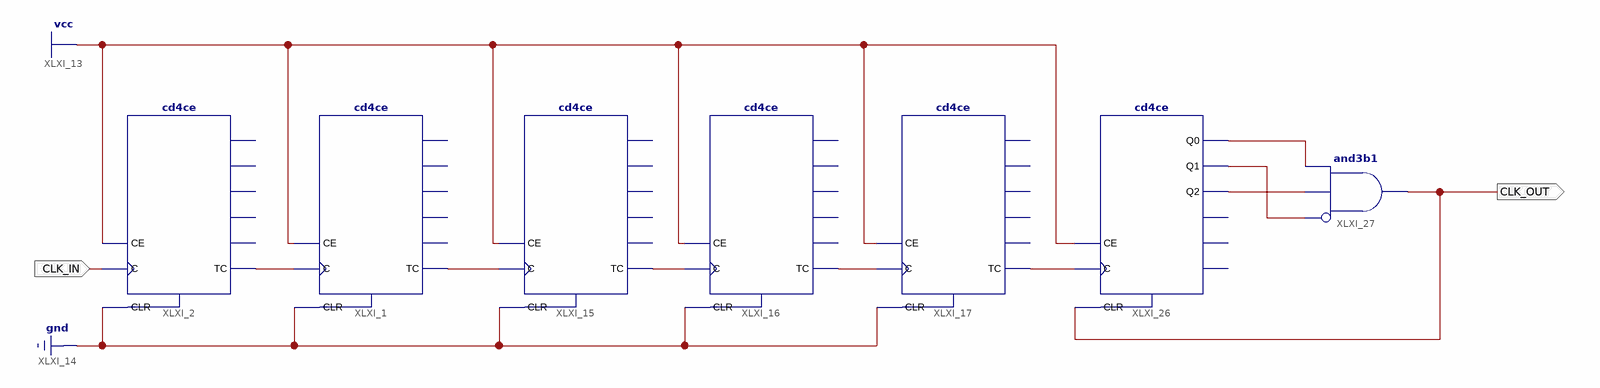
[diagram p0: schematic sheet 1]
// Xilinx ISE schematic DIV_500k.sch (spartan6) as structural Verilog: 7 symbols, 2 ports
module DIV_500k (
  input  CLK_IN,
  output CLK_OUT
);

  wire XLXN_1, XLXN_24, XLXN_25, XLXN_27, XLXN_53, XLXN_56, XLXN_58, XLXN_67;

  cd4ce XLXI_1 (.C(XLXN_1), .CE(1'b1), .CLR(1'b0), .TC(XLXN_24));  // open: CEO, Q0, Q1, Q2, Q3
  cd4ce XLXI_2 (.C(CLK_IN), .CE(1'b1), .CLR(1'b0), .TC(XLXN_1));  // open: CEO, Q0, Q1, Q2, Q3
  cd4ce XLXI_15 (.C(XLXN_24), .CE(1'b1), .CLR(1'b0), .TC(XLXN_25));  // open: CEO, Q0, Q1, Q2, Q3
  cd4ce XLXI_16 (.C(XLXN_25), .CE(1'b1), .CLR(1'b0), .TC(XLXN_27));  // open: CEO, Q0, Q1, Q2, Q3
  cd4ce XLXI_17 (.C(XLXN_27), .CE(1'b1), .CLR(1'b0), .TC(XLXN_53));  // open: CEO, Q0, Q1, Q2, Q3
  cd4ce XLXI_26 (.C(XLXN_53), .CE(1'b1), .CLR(CLK_OUT), .Q0(XLXN_56), .Q1(XLXN_58), .Q2(XLXN_67));  // open: CEO, Q3, TC
  and XLXI_27 (CLK_OUT, ~XLXN_58, XLXN_67, XLXN_56);  // and3b1
endmodule
